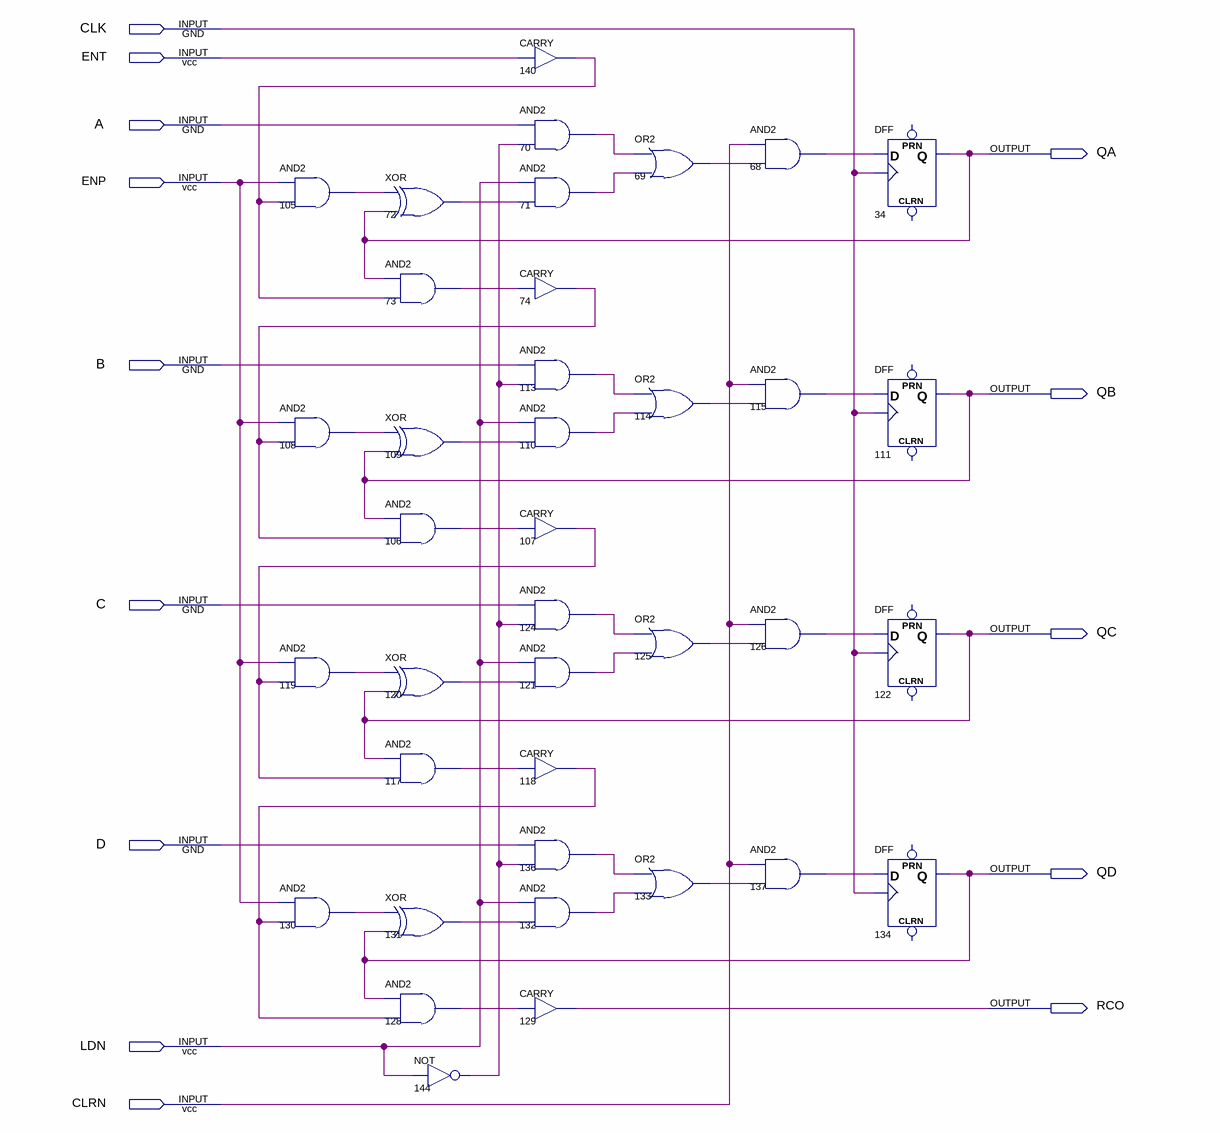
[diagram p0: schematic sheet]
// Quartus schematic f74163.bdf as structural Verilog: 38 symbols, 14 pins
module f74163 (
  input  CLK,
  input  ENT,
  input  A,
  input  ENP,
  input  B,
  input  C,
  input  D,
  input  LDN,
  input  CLRN,
  output QA,
  output QB,
  output QC,
  output QD,
  output RCO
);

  wire n68_out, n69_out, n70_out, n71_out, n72_out, n73_out, n74_out, n105_out, n106_out, n107_out, n108_out,
       n109_out, n110_out, n113_out, n114_out, n115_out, n117_out, n118_out, n119_out, n120_out, n121_out,
       n124_out, n125_out, n126_out, n128_out, n130_out, n131_out, n132_out, n133_out, n136_out, n137_out,
       n140_out, n144_out;

  and u_105 (n105_out, ENP, n140_out);
  and u_108 (n108_out, ENP, n74_out);
  and u_119 (n119_out, ENP, n107_out);
  and u_130 (n130_out, ENP, n118_out);
  xor u_72 (n72_out, n105_out, QA);
  and u_73 (n73_out, QA, n140_out);
  xor u_109 (n109_out, n108_out, QB);
  and u_106 (n106_out, QB, n74_out);
  xor u_120 (n120_out, n119_out, QC);
  and u_117 (n117_out, QC, n107_out);
  xor u_131 (n131_out, n130_out, QD);
  and u_128 (n128_out, QD, n118_out);
  not u_144 (n144_out, LDN);
  CARRY u_140 (.IN(ENT), .OUT(n140_out));
  and u_70 (n70_out, A, n144_out);
  and u_71 (n71_out, LDN, n72_out);
  CARRY u_74 (.IN(n73_out), .OUT(n74_out));
  and u_113 (n113_out, B, n144_out);
  and u_110 (n110_out, LDN, n109_out);
  CARRY u_107 (.IN(n106_out), .OUT(n107_out));
  and u_124 (n124_out, C, n144_out);
  and u_121 (n121_out, LDN, n120_out);
  CARRY u_118 (.IN(n117_out), .OUT(n118_out));
  and u_136 (n136_out, D, n144_out);
  and u_132 (n132_out, LDN, n131_out);
  CARRY u_129 (.IN(n128_out), .OUT(RCO));
  or u_69 (n69_out, n70_out, n71_out);
  or u_114 (n114_out, n113_out, n110_out);
  or u_125 (n125_out, n124_out, n121_out);
  or u_133 (n133_out, n136_out, n132_out);
  and u_68 (n68_out, CLRN, n69_out);
  and u_115 (n115_out, CLRN, n114_out);
  and u_126 (n126_out, CLRN, n125_out);
  and u_137 (n137_out, CLRN, n133_out);
  DFF u_34 (.CLK(CLK), .D(n68_out), .Q(QA));  // open: CLRN, PRN
  DFF u_111 (.CLK(CLK), .D(n115_out), .Q(QB));  // open: CLRN, PRN
  DFF u_122 (.CLK(CLK), .D(n126_out), .Q(QC));  // open: CLRN, PRN
  DFF u_134 (.CLK(CLK), .D(n137_out), .Q(QD));  // open: CLRN, PRN
endmodule
